# Altium schematic sheet top.SchDoc: Test
size A4; DrawnBy: Łukasz Przeniosło; Organization: Apptimia sp. z o.o.; Address1: Wojska Polskiego 184c/4; Address2: 71-256 Szczecin; Address3: www.apptimia.com; DocumentNumber: 1; Revision: 1; SheetNumber: 1; SheetTotal: 12
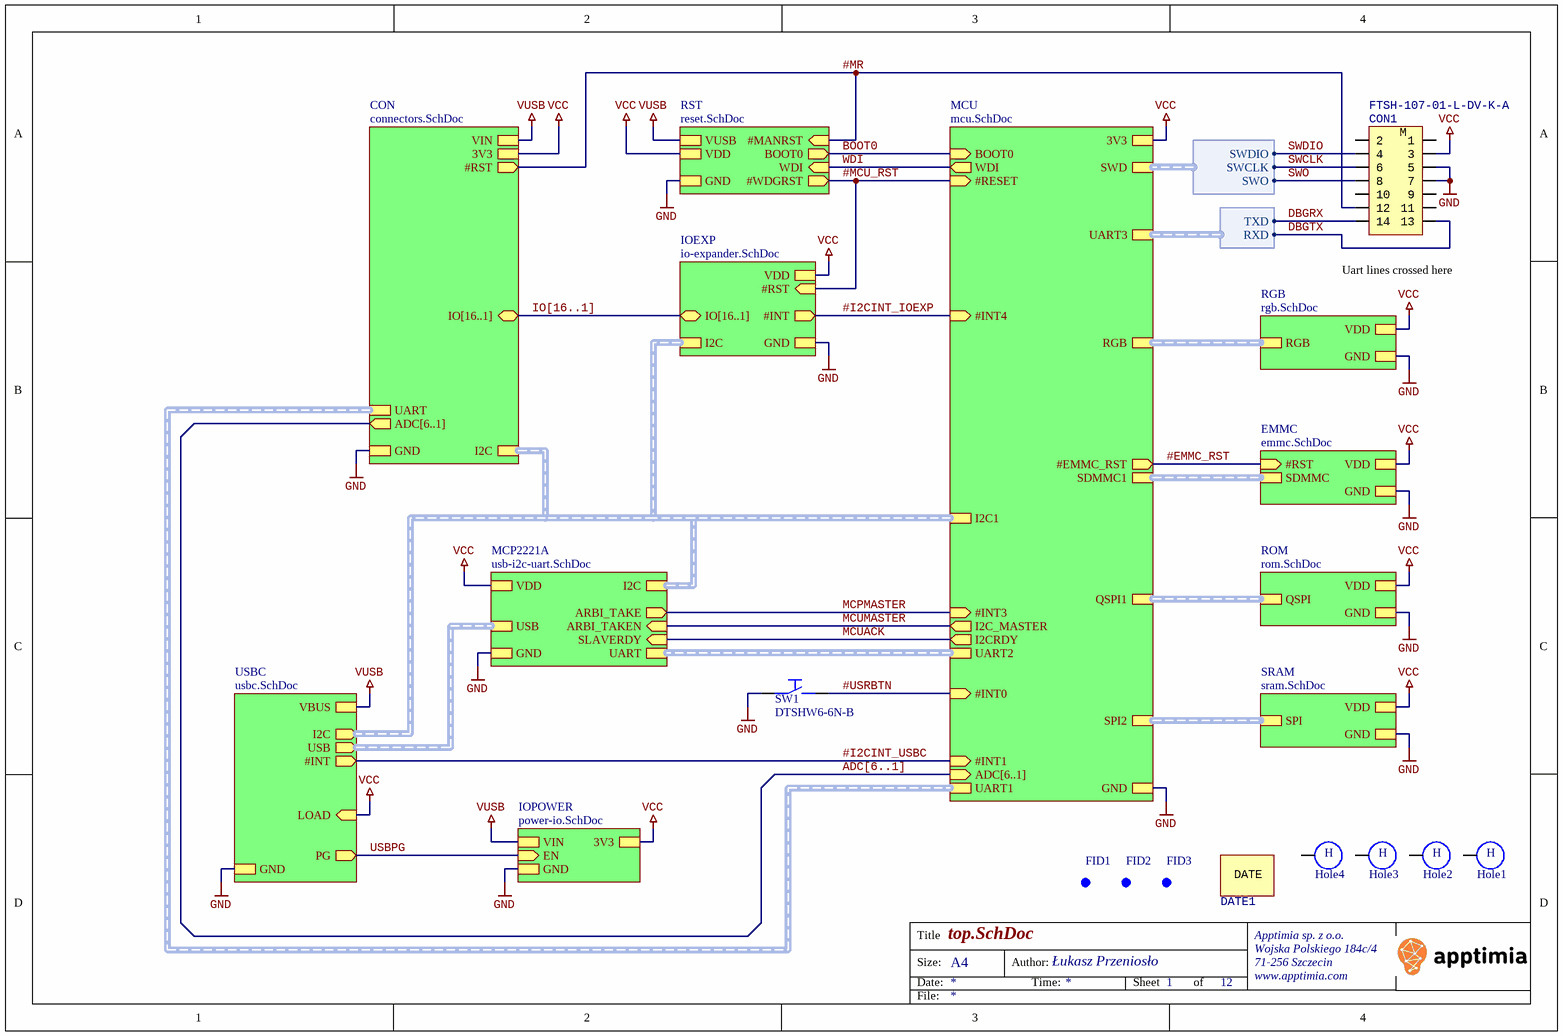
[diagram p0: top.SchDoc]

## Parts
CON1  FTSH-107-01-L-DV-K-A  [CON_SAMTEC_FTSH-107-01-L-DV-K-A]
DATE1  DATE  [DATE]  (value not drawn)
FID1  Fiducial  [Fid Round]  (value not drawn)  (no BOM)
FID2  Fiducial  [Fid Round]  (value not drawn)  (no BOM)
FID3  Fiducial  [Fid Round]  (value not drawn)  (no BOM)
Hole1  Hole  [Hole-4/3.2]  (value not drawn)
Hole2  Hole  [Hole-4/3.2]  (value not drawn)
Hole3  Hole  [Hole-4/3.2]  (value not drawn)
Hole4  Hole  [Hole-4/3.2]  (value not drawn)
SW1  DTSHW6-6N-B  [FSM2J]

## Sub-sheets
CON = connectors.SchDoc: 3V3, VIN, GND, ADC[6..1] (out), I2C (harness I2C), UART (harness UART), #RST (out), IO[16..1] (bidir)
EMMC = emmc.SchDoc: VDD, GND, #RST (in), SDMMC (harness SDIO)
IOEXP = io-expander.SchDoc: GND, VDD, I2C (harness I2C), #RST (in), #INT (out), IO[16..1] (bidir)
IOPOWER = power-io.SchDoc: 3V3, GND, EN (in), VIN
MCP2221A = usb-i2c-uart.SchDoc: GND, VDD, I2C (harness I2C), UART (harness UART), USB (harness USB), ARBI_TAKE (out), ARBI_TAKEN (in), SLAVERDY (in)
MCU = mcu.SchDoc: UART2 (harness UART2), I2C1 (harness I2C1), UART3 (harness UART3), SWD (harness SWD), #RESET (in), UART1 (harness UART1), RGB (harness RGB), GND, 3V3, #INT0 (in), SPI2 (harness SPI2), BOOT0 (in), #EMMC_RST (out), WDI (out), ADC[6..1] (in), #INT1 (in), I2C_MASTER (out), QSPI1 (harness QSPI1), #INT3 (in), SDMMC1 (harness SDMMC1), #INT4 (in), I2CRDY (out)
RGB = rgb.SchDoc: RGB (harness RGB), GND, VDD
ROM = rom.SchDoc: GND, VDD, QSPI (harness QSPI)
RST = reset.SchDoc: GND, VDD, #MANRST (in), #WDGRST (out), WDI (in), BOOT0 (out), VUSB
SRAM = sram.SchDoc: GND, VDD, SPI (harness SPI)
USBC = usbc.SchDoc: USB (out, harness USB), I2C (out, harness I2C), #INT (out), GND, VBUS, PG (out), LOAD (in)

## Harnesses
SWD: SWCLK, SWDIO, SWO
UART3: RXD, TXD

## Nets
GND: CON1.5 CON1.7 SW1.1 ; sheet IOPOWER/GND, sheet USBC/GND, sheet MCP2221A/GND, sheet SRAM/GND, sheet ROM/GND, sheet EMMC/GND, sheet MCU/GND, sheet CON/GND, sheet RST/GND, sheet RGB/GND, sheet IOEXP/GND
VCC: CON1.3 ; sheet IOPOWER/3V3, sheet USBC/LOAD, sheet MCP2221A/VDD, sheet SRAM/VDD, sheet ROM/VDD, sheet EMMC/VDD, sheet MCU/3V3, sheet CON/3V3, sheet RST/VDD, sheet RGB/VDD, sheet IOEXP/VDD
VUSB: sheet IOPOWER/VIN, sheet USBC/VBUS, sheet CON/VIN, sheet RST/VUSB
#EMMC_RST: sheet EMMC/#RST, sheet MCU/#EMMC_RST
#I2CINT_IOEXP: sheet MCU/#INT4, sheet IOEXP/#INT
#I2CINT_USBC: sheet USBC/#INT, sheet MCU/#INT1
#MCU_RST: sheet MCU/#RESET, sheet RST/#WDGRST, sheet IOEXP/#RST
#MR: CON1.12 ; sheet CON/#RST, sheet RST/#MANRST
#USRBTN: SW1.2 ; sheet MCU/#INT0
BOOT0: sheet MCU/BOOT0, sheet RST/BOOT0
DBGRX: CON1.14 ; sheet MCU/UART3.TXD
DBGTX: CON1.13 ; sheet MCU/UART3.RXD
MCPMASTER: sheet MCP2221A/ARBI_TAKE, sheet MCU/#INT3
MCUACK: sheet MCP2221A/SLAVERDY, sheet MCU/I2CRDY
MCUMASTER: sheet MCP2221A/ARBI_TAKEN, sheet MCU/I2C_MASTER
SWCLK: CON1.6 ; sheet MCU/SWD.SWCLK
SWDIO: CON1.4 ; sheet MCU/SWD.SWDIO
SWO: CON1.8 ; sheet MCU/SWD.SWO
USBPG: sheet IOPOWER/EN, sheet USBC/PG
WDI: sheet MCU/WDI, sheet RST/WDI

Not connected (* = marked no-connect by the designer): CON1 1 2 9 10 11; Hole1 1; Hole2 1; Hole3 1; Hole4 1

## Buses and harness runs
bus ADC[6..1] = sheet CON/ADC[6..1] = sheet MCU/ADC[6..1]
bus IO[16..1] = sheet CON/IO[16..1] = sheet IOEXP/IO[16..1]
harness sheet CON/I2C = sheet IOEXP/I2C = sheet MCP2221A/I2C = sheet MCU/I2C1 = sheet USBC/I2C
harness sheet CON/UART = sheet MCU/UART1
harness sheet EMMC/SDMMC = sheet MCU/SDMMC1
harness sheet MCP2221A/UART = sheet MCU/UART2
harness sheet MCP2221A/USB = sheet USBC/USB
harness sheet MCU/QSPI1 = sheet ROM/QSPI
harness sheet MCU/RGB = sheet RGB/RGB
harness sheet MCU/SPI2 = sheet SRAM/SPI

## Notes on the sheet
- (near CON1) Uart lines crossed here
- Title
- Size:
- Date:
- A4
- Author:
- Time:
- Sheet
- of
- File:
- (in symbol FTSH-107-01-L-DV-K-A) M
- (in symbol HOLE_) H

## Library data of the parts
CON1 = FTSH-107-01-L-DV-K-A: Header 7x2, 1.27mm, Dual row, Straight, "STDC14_MEDIUM" : footprint compatible with FTSH-107-01-L-DV,-K,-A,-P,-ES (use "STDC14_BIG" to also be compatible with SHF-107-01-L-D-SM,-K) and FTSH-105-01-L-DV-K (MIPI10); manid: FTSH-107-01-L-DV-K-A
FID1-FID3 = FID
Hole1-Hole4 = HOLE_
SW1 = DTSHW66NB: SWITCH, SPNO TACT; Published: 8-Jun-2000; LatestRevisionDate: 17-Jul-2002; LatestRevisionNote: Re-released for DXP Platform.; PackageDocument: Sep-1998; PackageReference: SOT-23A; Publisher: Altium Limited; ComponentLink1Description: Manufacturer Link; ComponentLink2Description: Datasheet; Distributor: tme.pl; tme.pl: DTSHW66NB; manid: DTSHW6-6N-B